# Altium schematic sheet ESD-INTERFACE.SchDoc
size A4; DocumentNumber: 2; SheetNumber: 1; SheetTotal: 5
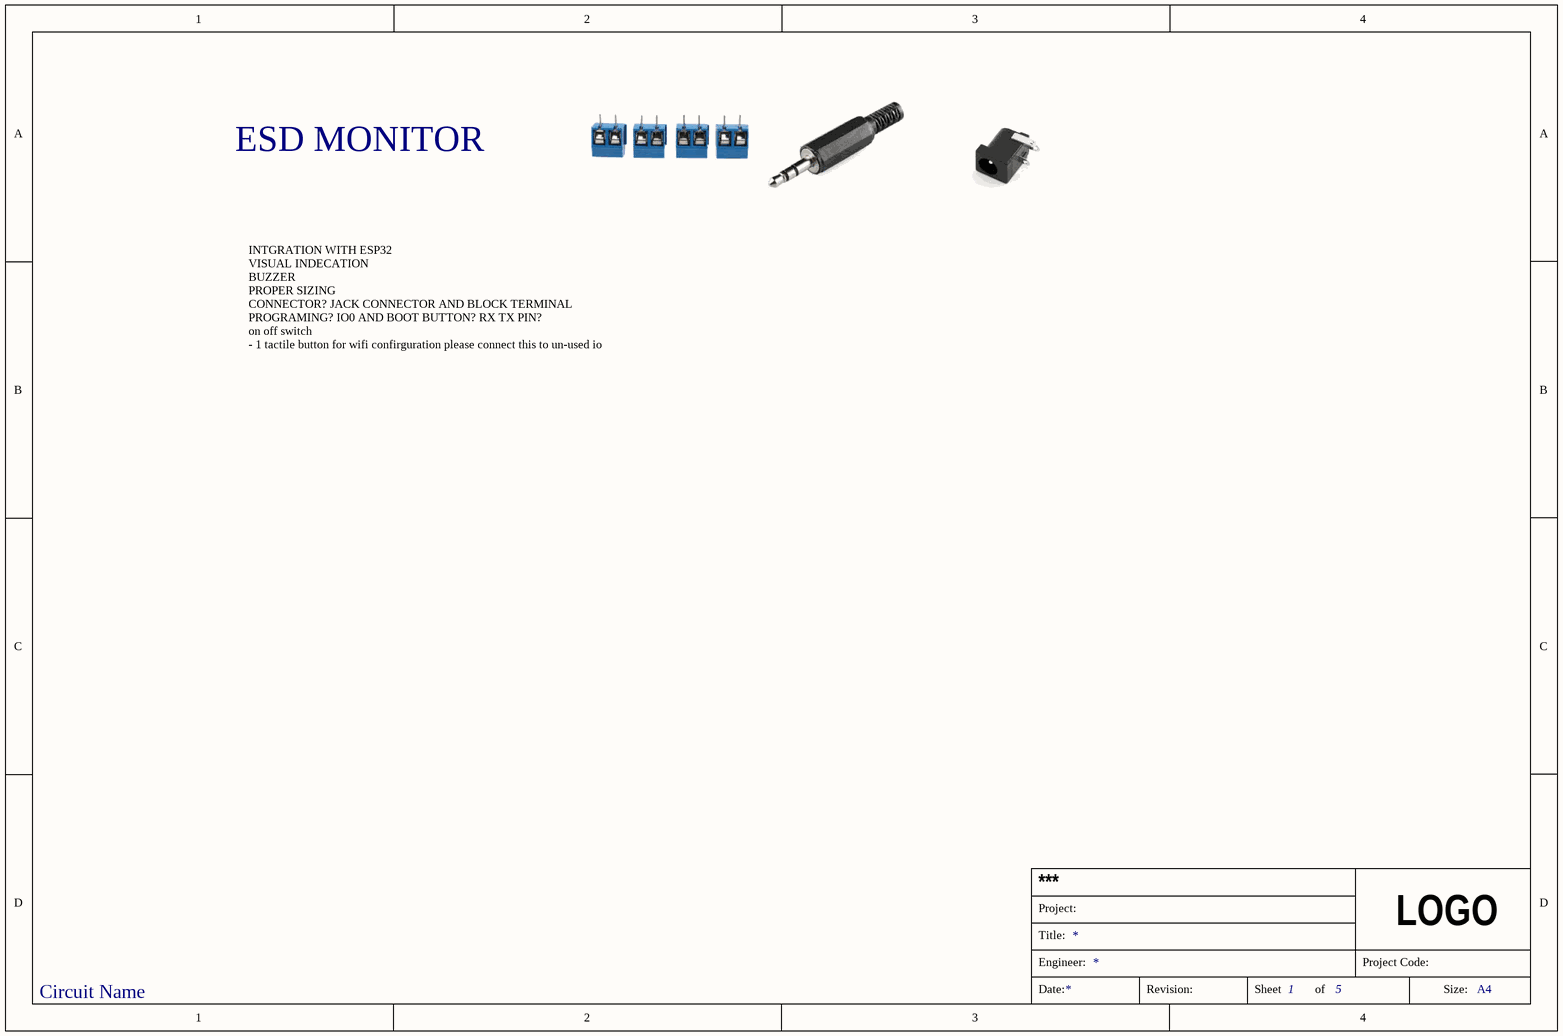
[diagram p0: ESD-INTERFACE.SchDoc]

## Notes on the sheet
- ESD MONITOR
- INTGRATION WITH ESP32
  VISUAL INDECATION
  BUZZER
  PROPER SIZING
  CONNECTOR? JACK CONNECTOR AND BLOCK TERMINAL
  PROGRAMING? IO0 AND BOOT BUTTON? RX TX PIN?
  on off switch
  - 1 tactile button for wifi confirguration please connect this to un-used io
- Circuit Name
- Project:
- ***
- Title:
- Engineer:
- Project Code:
- LOGO
- Date:
- Revision:
- Sheet
- of
- Size:
- A4